# Altium schematic sheet Memory.SchDoc
size 420 x 297 mm
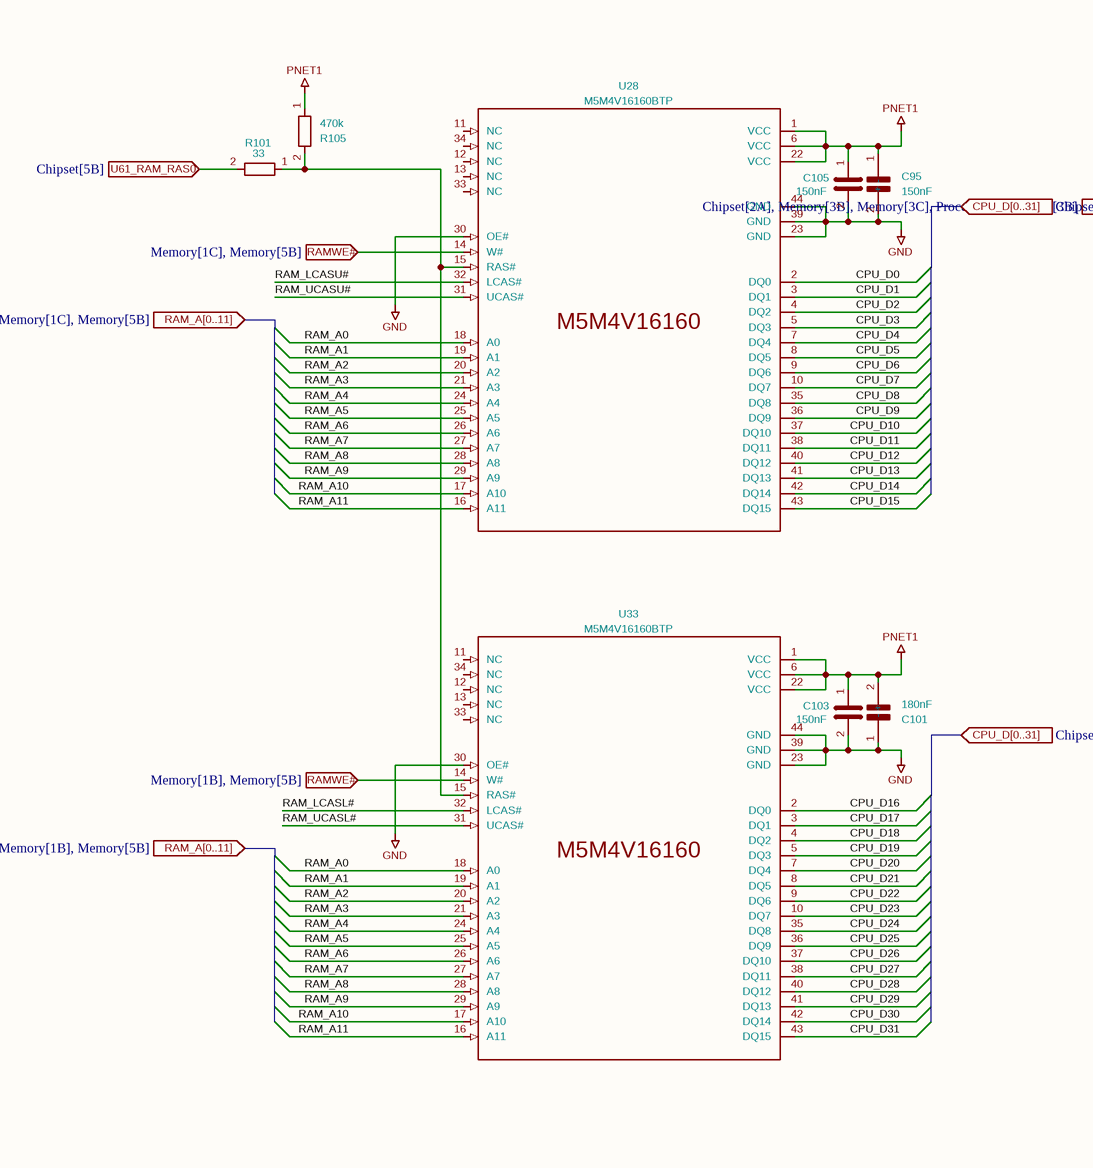
[diagram p0: Memory.SchDoc, left]
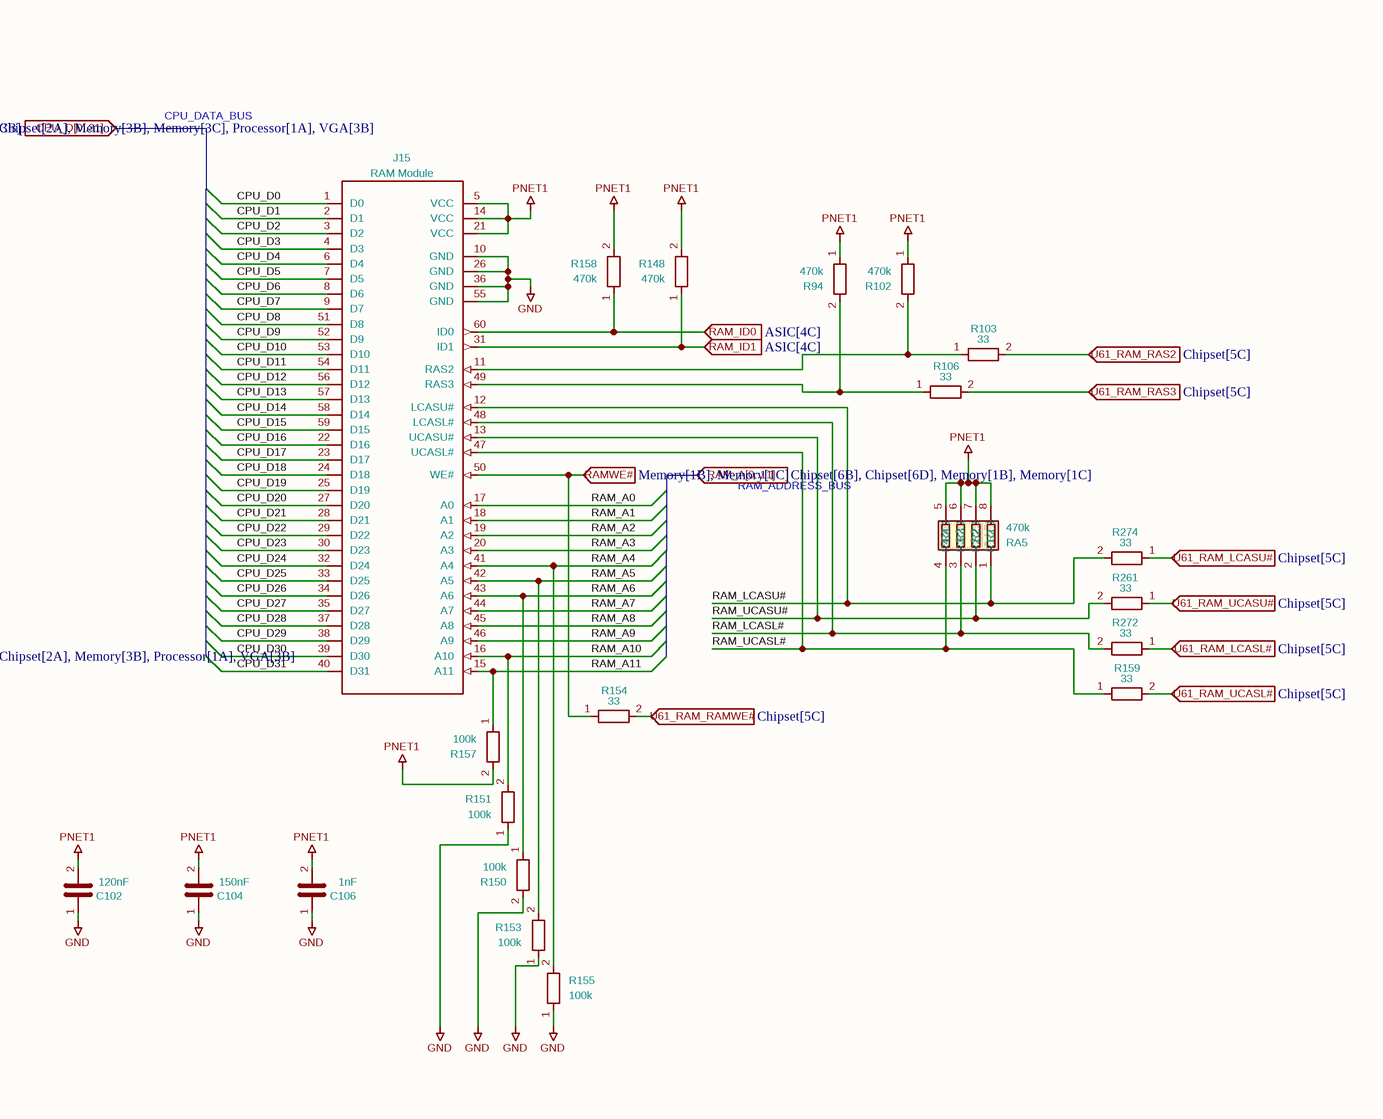
[diagram p1: Memory.SchDoc, right]

## Parts
C95  150nF  [C_0402_1005Metric]
C101  180nF  [C_0402_1005Metric]
C102  120nF  [C_0402_1005Metric]
C103  150nF  [C_0402_1005Metric]
C104  150nF  [C_0402_1005Metric]
C105  150nF  [C_0402_1005Metric]
C106  1nF  [C_0402_1005Metric]
J15  RAM Module  [RAM Module]
R94  470k  [R_0402_1005Metric]
R101  33  [R_0402_1005Metric]
R102  470k  [R_0402_1005Metric]
R103  33  [R_0402_1005Metric]
R105  470k  [R_0402_1005Metric]
R106  33  [R_0402_1005Metric]
R148  470k  [R_0402_1005Metric]
R150  100k  [R_0402_1005Metric]
R151  100k  [R_0402_1005Metric]
R153  100k  [R_0402_1005Metric]
R154  33  [R_0402_1005Metric]
R155  100k  [R_0402_1005Metric]
R157  100k  [R_0402_1005Metric]
R158  470k  [R_0402_1005Metric]
R159  33  [R_0402_1005Metric]
R261  33  [R_0402_1005Metric]
R272  33  [R_0402_1005Metric]
R274  33  [R_0402_1005Metric]
RA5  470k  [R-array]
U28  M5M4V16160BTP  [RAMchip]
U33  M5M4V16160BTP  [RAMchip]

## Ports
CPU_D[0..31] (in, see Chipset[2A], Memory[3B], Memory[3C], Processor[1A], VGA[3B]), CPU_D[0..31] (in, see Chipset[2A], Memory[3B], Processor[1A], VGA[3B]), RAM_A[0..11] (in, see Chipset[6B], Chipset[6D], Memory[1B], Memory[1C]), RAM_A[0..11] (in, see Chipset[6B], Chipset[6D], Memory[1B], Memory[5B]), RAM_A[0..11] (in, see Chipset[6B], Chipset[6D], Memory[1C], Memory[5B]), RAM_ID0 (in, see ASIC[4C]), RAM_ID1 (in, see ASIC[4C]), RAMWE# (in, see Memory[1B], Memory[1C]), RAMWE# (in, see Memory[1B], Memory[5B]), RAMWE# (in, see Memory[1C], Memory[5B]), U61_RAM_LCASL# (in, see Chipset[5C]), U61_RAM_LCASU# (in, see Chipset[5C]), U61_RAM_RAMWE# (in, see Chipset[5C]), U61_RAM_RAS0 (in, see Chipset[5B]), U61_RAM_RAS2 (in, see Chipset[5C]), U61_RAM_RAS3 (in, see Chipset[5C]), U61_RAM_UCASL# (in, see Chipset[5C]), U61_RAM_UCASU# (in, see Chipset[5C])

## Nets
GND: C95.2(-) C101.1(+) C102.1 C103.2 C104.1 C105.2 C106.1 J15.10(GND) J15.26(GND) J15.36(GND) J15.55(GND) R150.2 R151.1 R153.1 R155.1 U28.23(GND) U28.30(OE#) U28.39(GND) U28.44(GND) U33.23(GND) U33.30(OE#) U33.39(GND) U33.44(GND)
PNET1: C95.1(+) C101.2(-) C102.2 C103.1 C104.2 C105.1 C106.2 J15.5(VCC) J15.14(VCC) J15.21(VCC) R94.1 R102.1 R105.1 R148.2 R157.2 R158.2 RA5.5(R4.2) RA5.6(R3.2) RA5.7(R2.2) RA5.8(R1.2) U28.1(VCC) U28.6(VCC) U28.22(VCC) U33.1(VCC) U33.6(VCC) U33.22(VCC)
CPU_D0: J15.1(D0) U28.2(DQ0)
CPU_D1: J15.2(D1) U28.3(DQ1)
CPU_D2: J15.3(D2) U28.4(DQ2)
CPU_D3: J15.4(D3) U28.5(DQ3)
CPU_D4: J15.6(D4) U28.7(DQ4)
CPU_D5: J15.7(D5) U28.8(DQ5)
CPU_D6: J15.8(D6) U28.9(DQ6)
CPU_D7: J15.9(D7) U28.10(DQ7)
CPU_D8: J15.51(D8) U28.35(DQ8)
CPU_D9: J15.52(D9) U28.36(DQ9)
CPU_D10: J15.53(D10) U28.37(DQ10)
CPU_D11: J15.54(D11) U28.38(DQ11)
CPU_D12: J15.56(D12) U28.40(DQ12)
CPU_D13: J15.57(D13) U28.41(DQ13)
CPU_D14: J15.58(D14) U28.42(DQ14)
CPU_D15: J15.59(D15) U28.43(DQ15)
CPU_D16: J15.22(D16) U33.2(DQ0)
CPU_D17: J15.23(D17) U33.3(DQ1)
CPU_D18: J15.24(D18) U33.4(DQ2)
CPU_D19: J15.25(D19) U33.5(DQ3)
CPU_D20: J15.27(D20) U33.7(DQ4)
CPU_D21: J15.28(D21) U33.8(DQ5)
CPU_D22: J15.29(D22) U33.9(DQ6)
CPU_D23: J15.30(D23) U33.10(DQ7)
CPU_D24: J15.32(D24) U33.35(DQ8)
CPU_D25: J15.33(D25) U33.36(DQ9)
CPU_D26: J15.34(D26) U33.37(DQ10)
CPU_D27: J15.35(D27) U33.38(DQ11)
CPU_D28: J15.37(D28) U33.40(DQ12)
CPU_D29: J15.38(D29) U33.41(DQ13)
CPU_D30: J15.39(D30) U33.42(DQ14)
CPU_D31: J15.40(D31) U33.43(DQ15)
RAM_A0: J15.17(A0) U28.18(A0) U33.18(A0)
RAM_A1: J15.18(A1) U28.19(A1) U33.19(A1)
RAM_A2: J15.19(A2) U28.20(A2) U33.20(A2)
RAM_A3: J15.20(A3) U28.21(A3) U33.21(A3)
RAM_A4: J15.41(A4) R155.2 U28.24(A4) U33.24(A4)
RAM_A5: J15.42(A5) R153.2 U28.25(A5) U33.25(A5)
RAM_A6: J15.43(A6) R150.1 U28.26(A6) U33.26(A6)
RAM_A7: J15.44(A7) U28.27(A7) U33.27(A7)
RAM_A8: J15.45(A8) U28.28(A8) U33.28(A8)
RAM_A9: J15.46(A9) U28.29(A9) U33.29(A9)
RAM_A10: J15.16(A10) R151.2 U28.17(A10) U33.17(A10)
RAM_A11: J15.15(A11) R157.1 U28.16(A11) U33.16(A11)
RAM_ID0: J15.60(ID0) R158.1 ; port RAM_ID0
RAM_ID1: J15.31(ID1) R148.1 ; port RAM_ID1
RAM_LCASL#: J15.48(LCASL#) R272.2 RA5.3(R3.1) U33.32(LCAS#)
RAM_LCASU#: J15.12(LCASU#) R274.2 RA5.1(R1.1) U28.32(LCAS#)
RAM_UCASL#: J15.47(UCASL#) R159.1 RA5.4(R4.1) U33.31(UCAS#)
RAM_UCASU#: J15.13(UCASU#) R261.2 RA5.2(R2.1) U28.31(UCAS#)
RAMWE#: J15.50(WE#) R154.1 U28.14(W#) U33.14(W#) ; port RAMWE#
U61_RAM_LCASL#: R272.1 ; port U61_RAM_LCASL#
U61_RAM_LCASU#: R274.1 ; port U61_RAM_LCASU#
U61_RAM_RAMWE#: R154.2 ; port U61_RAM_RAMWE#
U61_RAM_RAS0: R101.2 ; port U61_RAM_RAS0
U61_RAM_RAS2: R103.2 ; port U61_RAM_RAS2
U61_RAM_RAS3: R106.2 ; port U61_RAM_RAS3
U61_RAM_UCASL#: R159.2 ; port U61_RAM_UCASL#
U61_RAM_UCASU#: R261.1 ; port U61_RAM_UCASU#
NetJ15_11: J15.11(RAS2) R102.2 R103.1
NetJ15_49: J15.49(RAS3) R94.2 R106.1
NetR101_1: R101.1 R105.2 U28.15(RAS#) U33.15(RAS#)

Not connected (* = marked no-connect by the designer): U28 11(NC) 12(NC) 13(NC) 33(NC) 34(NC); U33 11(NC) 12(NC) 13(NC) 33(NC) 34(NC)

## Notes on the sheet
- CPU_DATA_BUS
- RAM_ADDRESS_BUS
- 1
- 2
- 3
- 4
- 5
- 6
- 7
- 8
- A
- B
- C
- D
- E
- Title: PC110
- File: Memory.kicad_sch
- Sheet: /
- Recreated by: Ahmad Byagowi
- F
- KiCad E.D.A.  kicad (5.1.4)-1
- Size: A3
- Date:
- Rev:
- Id: 1/1

## Library data of the parts
C95 C101-C106 = C: Footprint: Capacitor_SMD:C_0402_1005Metric
  C95 C103-C105: Value: 150nF
  C101: Value: 180nF
  C102: Value: 120nF
  C106: Value: 1nF
J15 = RAM_MOD: Value: RAM Module; Footprint: PC110:RAM Module
R94 R101-R103 R105 R106 R148 R150 R151 R153-R155 R157-R159 R261 R272 R274 = R: Footprint: PCM_Resistor_SMD_AKL:R_0402_1005Metric
  R94 R102 R105 R148 R158: Value: 470k
  R101 R103 R106 R154 R159 R261 R272 R274: Value: 33
  R150 R151 R153 R155 R157: Value: 100k
RA5 = R_Pack04: Value: 470k; Footprint: PC110:R-array
U28 U33 = M5M4V16160: Value: M5M4V16160BTP; Footprint: PC110:RAMchip